# Altium schematic sheet Вариант8.SchDoc
size A4; SheetNumber: 8; SheetTotal: 10
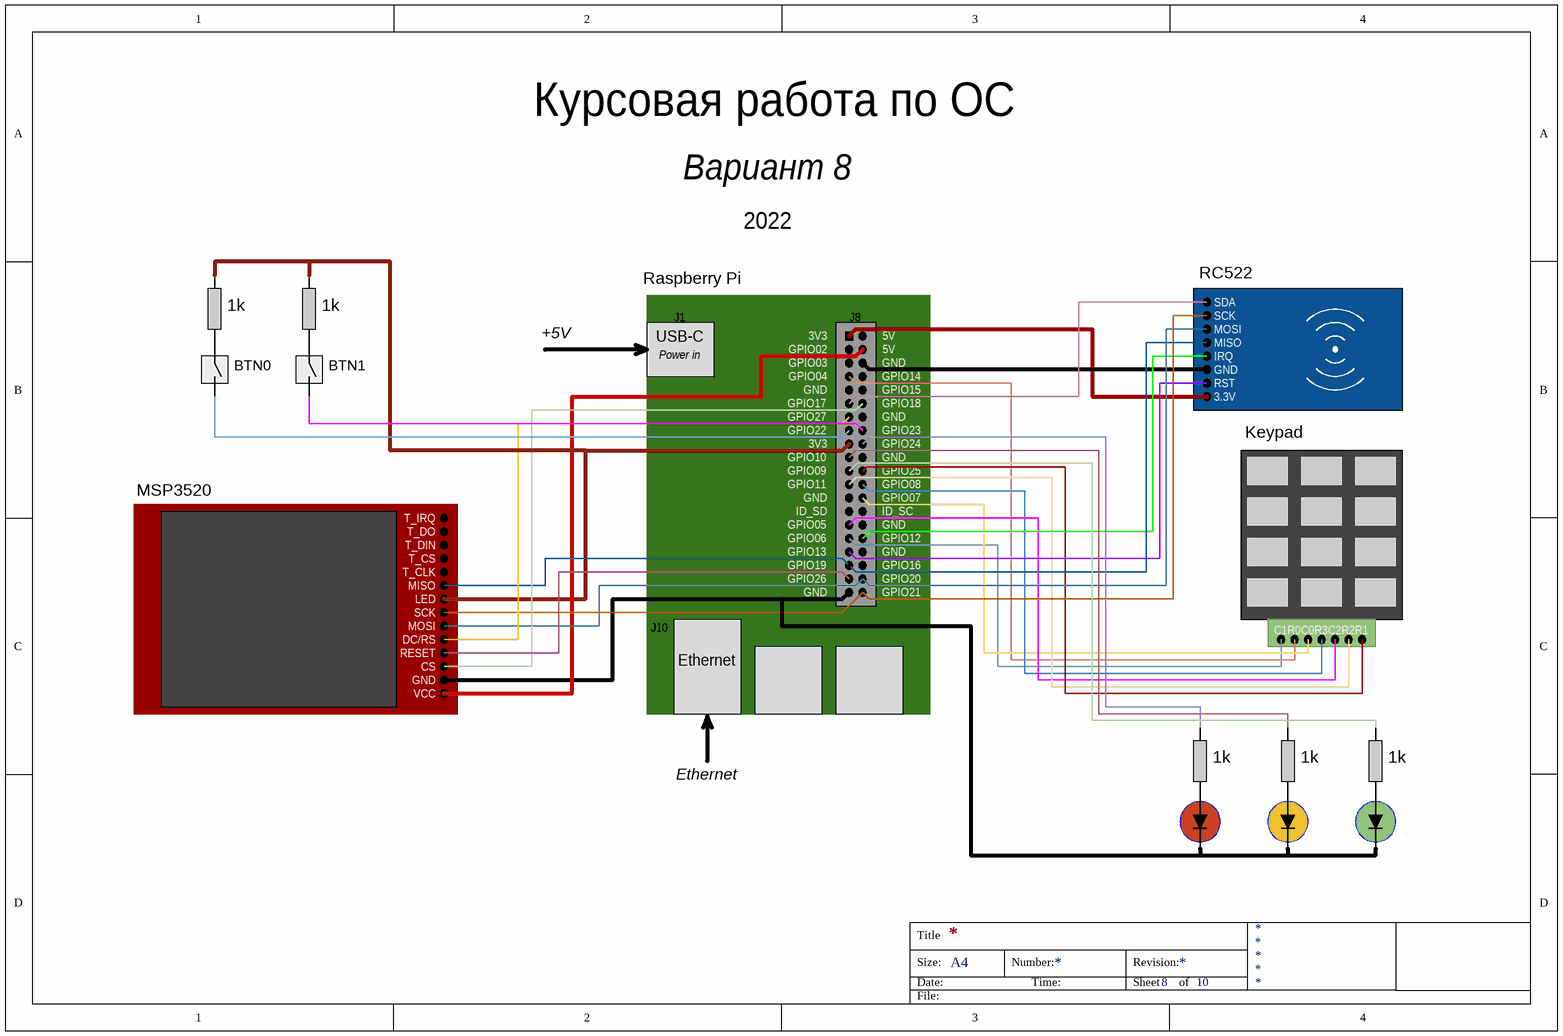
[diagram p0: Вариант8.SchDoc]

## Notes on the sheet
- Курсовая работа по ОС
- Вариант 8
- 2022
- 1k
- Raspberry Pi
- J1
- J8
- RC522
- SDA
- SCK
- BTN0
- BTN1
- +5V
- USB-C
- Power in
- 3V3
- GPIO02
- GPIO03
- GPIO04
- GND
- GPIO14
- GPIO15
- 5V
- MOSI
- MISO
- IRQ
- RST
- GPIO17
- GPIO27
- GPIO22
- GPIO18
- GPIO23
- GPIO24
- 3.3V
- Keypad
- MSP3520
- T_IRQ
- GPIO09
- GPIO10
- GPIO11
- GPIO05
- ID_SD
- GPIO25
- GPIO08
- GPIO07
- ID_SC
- T_DO
- T_DIN
- T_CS
- T_CLK
- GPIO06
- GPIO13
- GPIO19
- GPIO26
- GPIO12
- GPIO16
- GPIO20
- RESET
- DC/RS
- LED
- J10
- Ethernet
- GPIO21
- C1
- R0
- C0
- R3
- C2
- R2
- R1
- VCC
- CS
- Title
- Size:
- Date:
- A4
- Number:
- Time:
- Revision:
- Sheet
- of
- File: